# EAGLE design blink1stick_v1a (EAGLE 6.6.0)
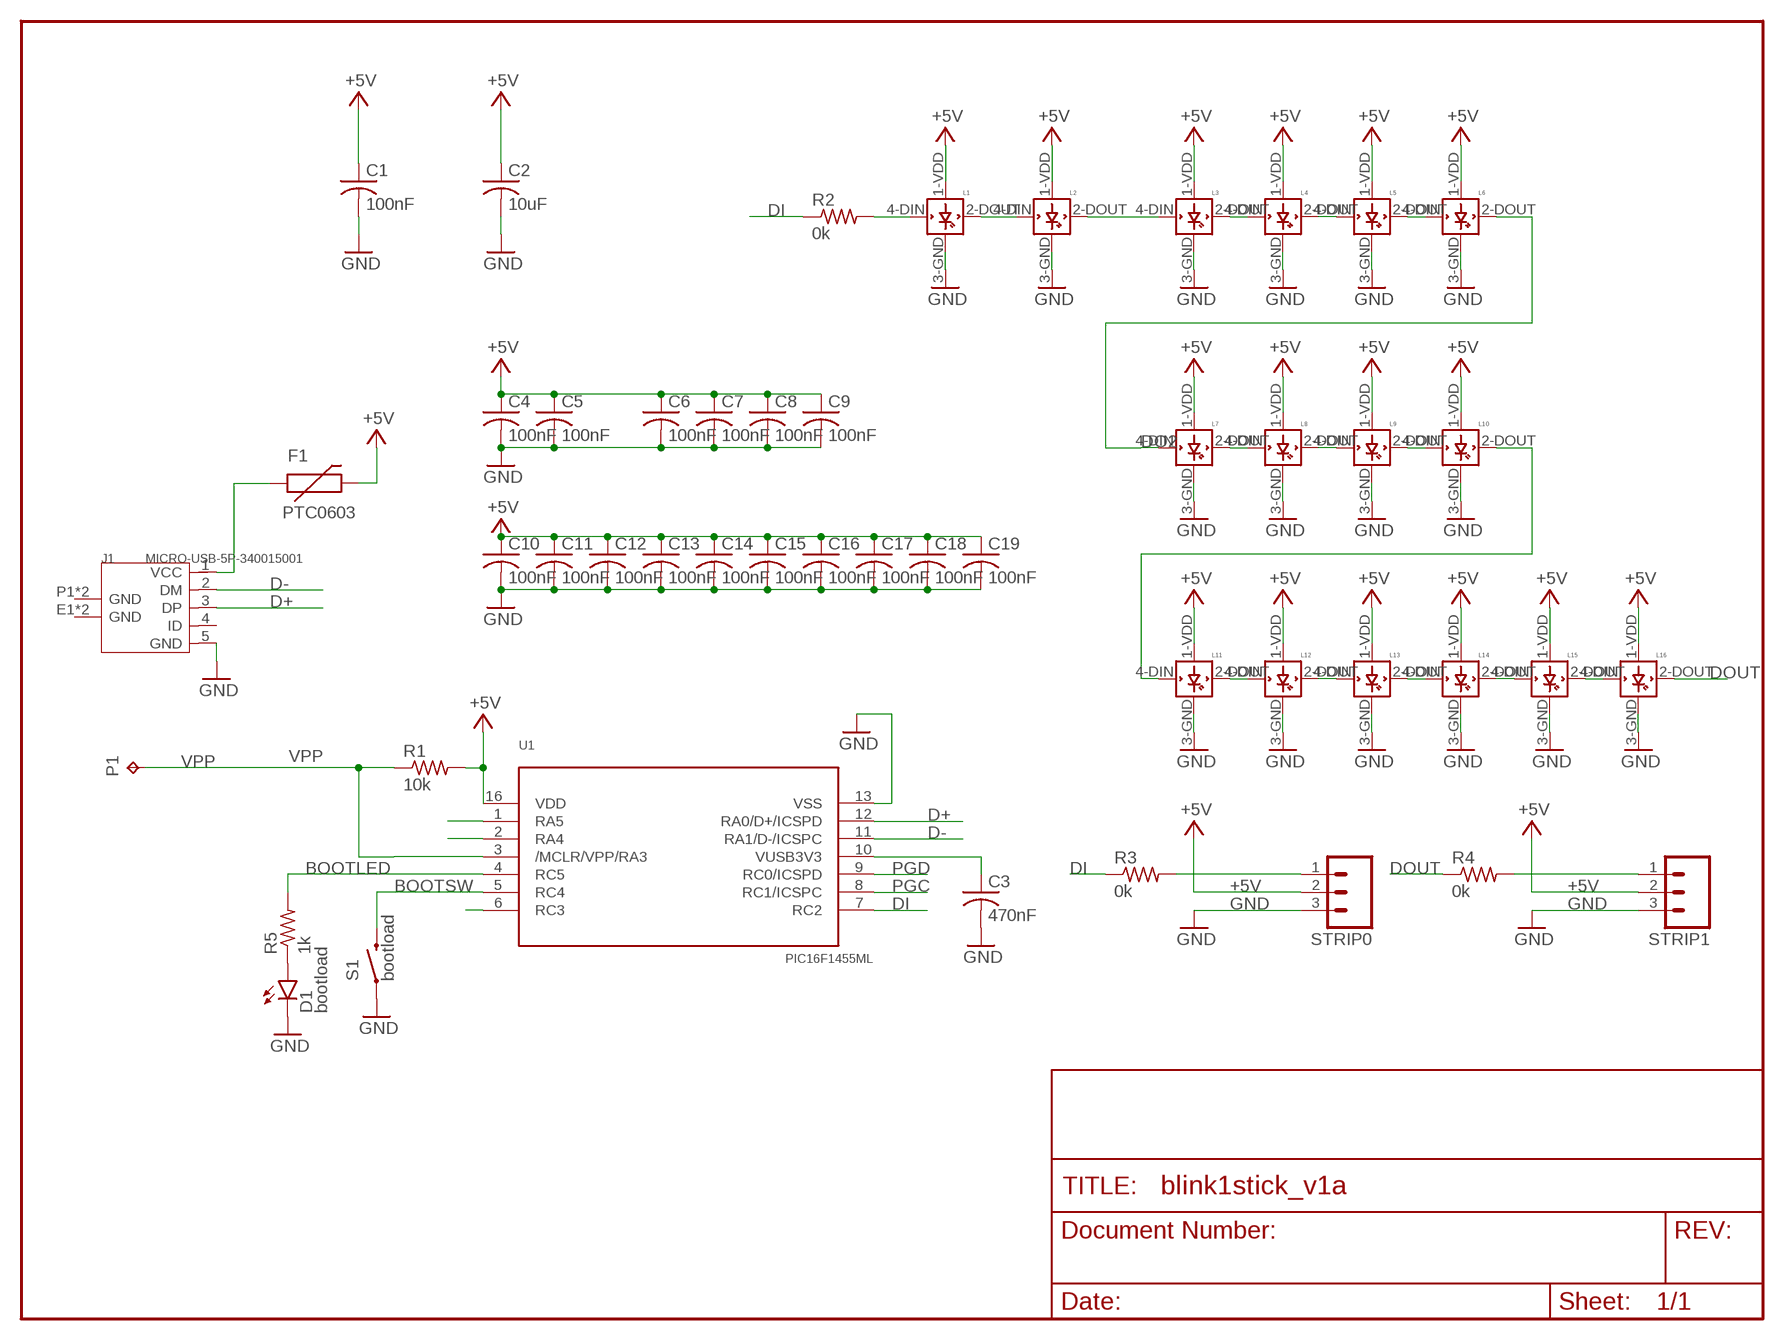
[diagram p0: schematic, sheet 1]

## Parts
C1  100nF  C-USC0603  [C0603]
C2  10uF  C-USC0603  [C0603]
C3  470nF  C-USC0603  [C0603]
C4  100nF  C-USC0603  [C0603]
C5  100nF  C-USC0603  [C0603]
C6  100nF  C-USC0603  [C0603]
C7  100nF  C-USC0603  [C0603]
C8  100nF  C-USC0603  [C0603]
C9  100nF  C-USC0603  [C0603]
C10  100nF  C-USC0603  [C0603]
C11  100nF  C-USC0603  [C0603]
C12  100nF  C-USC0603  [C0603]
C13  100nF  C-USC0603  [C0603]
C14  100nF  C-USC0603  [C0603]
C15  100nF  C-USC0603  [C0603]
C16  100nF  C-USC0603  [C0603]
C17  100nF  C-USC0603  [C0603]
C18  100nF  C-USC0603  [C0603]
C19  100nF  C-USC0603  [C0603]
D1  bootload  LED-RED0603  [LED-0603]
F1  PTC0603  [0603]
J1  MICRO-USB-5P-340015001  [B-SMD-5P]
L1  WS2812B  [WS2812B]
L2  WS2812B  [WS2812B]
L3  WS2812B  [WS2812B]
L4  WS2812B  [WS2812B]
L5  WS2812B  [WS2812B]
L6  WS2812B  [WS2812B]
L7  WS2812B  [WS2812B]
L8  WS2812B  [WS2812B]
L9  WS2812B  [WS2812B]
L10  WS2812B  [WS2812B]
L11  WS2812B  [WS2812B]
L12  WS2812B  [WS2812B]
L13  WS2812B  [WS2812B]
L14  WS2812B  [WS2812B]
L15  WS2812B  [WS2812B]
L16  WS2812B  [WS2812B]
P1  TPTP11SQ  [TP11SQ]
R1  10k  R-US_R0603  [R0603]
R2  0k  R-US_R0603  [R0603]
R3  0k  R-US_R0603  [R0603]
R4  0k  R-US_R0603  [R0603]
R5  1k  R-US_R0603  [R0603]
S1  bootload  SWITCH-MOMENTARY-2TACTILE-SWITCH-SMD-RIGHT-ANGLE  [TACTILE_SWITCH-SMD-RIGHT-ANGLE]
STRIP0  M03PTH  [1X03]
STRIP1  M03PTH  [1X03]
U1  PIC16F1455ML  [QFN16_4X4]

## Nets
+5V: C1.1 C2.1 C4.1 C5.1 C6.1 C7.1 C8.1 C9.1 C10.1 C11.1 C12.1 C13.1 C14.1 C15.1 C16.1 C17.1 C18.1 C19.1 F1.2 L1.1-VDD(VDD) L2.1-VDD(VDD) L3.1-VDD(VDD) L4.1-VDD(VDD) L5.1-VDD(VDD) L6.1-VDD(VDD) L7.1-VDD(VDD) L8.1-VDD(VDD) L9.1-VDD(VDD) L10.1-VDD(VDD) L11.1-VDD(VDD) L12.1-VDD(VDD) L13.1-VDD(VDD) L14.1-VDD(VDD) L15.1-VDD(VDD) L16.1-VDD(VDD) R1.2 STRIP0.2 STRIP1.2 U1.16(VDD)
BOOTLED: R5.2 U1.4(RC5)
BOOTSW: S1.2 U1.5(RC4)
D+: J1.3(DP) U1.12(RA0/D+/ICSPD)
D-: J1.2(DM) U1.11(RA1/D-/ICSPC)
DI: R2.1 R3.1 U1.7(RC2)
DO1: L2.2-DOUT(DOUT) L3.4-DIN(DIN)
DO2: L6.2-DOUT(DOUT) L7.4-DIN(DIN)
DO3: L10.2-DOUT(DOUT) L11.4-DIN(DIN)
DOUT: L16.2-DOUT(DOUT) R4.1
GND: C1.2 C2.2 C3.2 C4.2 C5.2 C6.2 C7.2 C8.2 C9.2 C10.2 C11.2 C12.2 C13.2 C14.2 C15.2 C16.2 C17.2 C18.2 C19.2 D1.C J1.5(GND) L1.3-GND(GND) L2.3-GND(GND) L3.3-GND(GND) L4.3-GND(GND) L5.3-GND(GND) L6.3-GND(GND) L7.3-GND(GND) L8.3-GND(GND) L9.3-GND(GND) L10.3-GND(GND) L11.3-GND(GND) L12.3-GND(GND) L13.3-GND(GND) L14.3-GND(GND) L15.3-GND(GND) L16.3-GND(GND) S1.1 STRIP0.3 STRIP1.3 U1.13(VSS)
N$1: L3.2-DOUT(DOUT) L4.4-DIN(DIN)
N$2: L1.2-DOUT(DOUT) L2.4-DIN(DIN)
N$3: L5.2-DOUT(DOUT) L6.4-DIN(DIN)
N$4: L4.2-DOUT(DOUT) L5.4-DIN(DIN)
N$5: L7.2-DOUT(DOUT) L8.4-DIN(DIN)
N$6: L9.2-DOUT(DOUT) L10.4-DIN(DIN)
N$7: L8.2-DOUT(DOUT) L9.4-DIN(DIN)
N$8: L11.2-DOUT(DOUT) L12.4-DIN(DIN)
N$9: L13.2-DOUT(DOUT) L14.4-DIN(DIN)
N$10: L12.2-DOUT(DOUT) L13.4-DIN(DIN)
N$11: L1.4-DIN(DIN) R2.2
N$12: R3.2 STRIP0.1
N$13: R4.2 STRIP1.1
N$14: L15.2-DOUT(DOUT) L16.4-DIN(DIN)
N$15: L14.2-DOUT(DOUT) L15.4-DIN(DIN)
N$16: U1.6(RC3)
N$19: U1.2(RA4)
N$20: U1.1(RA5)
N$21: D1.A R5.1
PGC: U1.8(RC1/ICSPC)
PGD: U1.9(RC0/ICSPD)
VPP: P1.TP R1.1 U1.3(/MCLR/VPP/RA3)
VUSB: F1.1 J1.1(VCC)
VUSB3V3: C3.1 U1.10(VUSB3V3)
Unconnected: J1.4(ID) J1.E1(GND) J1.E2(GND) J1.P1(GND) J1.P2(GND)

## Library data of the parts
C1-C19 = rcl:C-US: CAPACITOR, American symbol
D1 = SparkFun-LED:LED-RED: Assorted Red LEDs LilyPad 1206- DIO-09912 1206- DIO-00809 0603- DIO-00819; PROD_ID: DIO-00819; VALUE: RED
F1 = SparkFun-PowerIC:PTC: Resettable Fuse PTC Resettable Fuse. Spark Fun Electronics SKU : COM-08357
J1 = OPL Eagle Library:MICRO-USB-5P: ST-USB-001E：MICRO USB B SMD R/A
L1-L16 = adafruit:WS2812B
P1 = testpad:TP: Test pad
R1-R5 = rcl:R-US_: RESISTOR, American symbol
S1 = SparkFun-Electromechanical:SWITCH-MOMENTARY-2: Various NO switches- pushbuttons, reed, etc; PROD_ID: COMP-12265
STRIP0 STRIP1 = SparkFun-Connectors:M03: Header 3 Standard 3-pin 0.1" header. Use with straight break away headers (SKU : PRT-00116), right angle break away headers (PRT-00553), swiss pins (PRT-00743), machine pins (PRT-00117), and female headers (PRT-00115). Molex polarized connector foot print use with SKU : PRT-08232 with associated crimp pins and housings.
U1 = todstuffnew:PIC16F1455

## Board
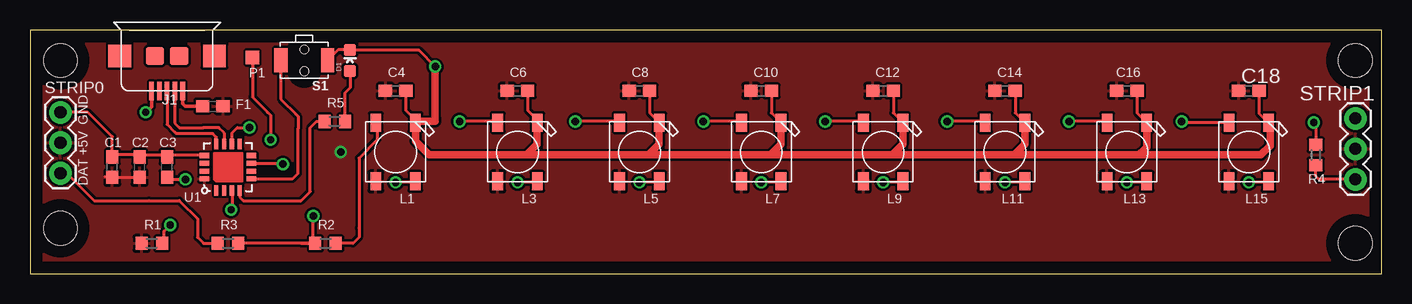
[diagram p1: board, top side]
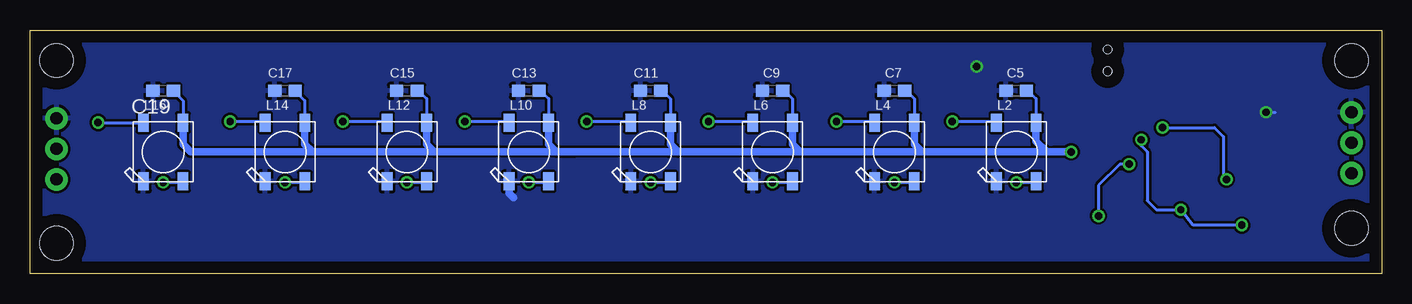
[diagram p2: board, bottom side, seen from below]

Size 112.7 x 20.3 mm. Coordinates in mm from the lower left corner, seen from the top.
Outline: 0,20.3 0,0 112.7,0 112.7,20.3 0,20.3
Copper layers (1*16): Top 0.035mm / dielectric 1.5mm / Bottom 0.035mm
Design rules "default": minimum track width 10mil, minimum drill 24mil, track to track 8mil, track to pad 8mil, pad to pad 8mil, via to via 8mil, smd to smd 8mil, copper to edge 40mil, drill to drill 8mil, minimum pad ring 10mil, minimum via ring 8mil, stop-mask expansion 4mil, vias tented up to drill 0mil, thermal gap 10mil
Holes 2.8 mm at 2.54,17.76 2.54,3.79 110.49,17.76 110.49,2.52

### Footprints (pad centres in the part's own frame; a part is rotated, then mirrored left to right if it is on the bottom)
C0603 = smd 1.1 x 1: 1 -0.85,0; 2 0.85,0
LED-0603 = smd 1 x 1: A 0,-0.877; C 0,0.877
0603 = smd 1.1 x 1: 1 -0.85,0; 2 0.85,0
B-SMD-5P = smd 0.38 x 1.52: 1 -1.3,2.54; 2 -0.65,2.54; 3 0,2.54; 4 0.65,2.54; 5 1.3,2.54 | smd 1.524 x 1.524: E1 -1.016,-0.381; E2 1.016,-0.381 | smd 1.9 x 1.9: P1 -3.95,-0.381; P2 3.95,-0.381
WS2812B = smd 1.5 x 0.9: 1-VDD 2.45,-1.65; 2-DOUT 2.45,1.65; 3-GND -2.45,1.65; 4-DIN -2.45,-1.65
TP11SQ = smd 1.1 x 1.1: TP 0,0
R0603 = smd 1 x 1.1: 1 -0.85,0; 2 0.85,0
TACTILE_SWITCH-SMD-RIGHT-ANGLE = smd 1.1 x 2: 1 -1.95,0; 2 1.95,0 | hole 0.7: 0,0.9; 0,-0.9
1X03 = drill 1.016 pad 1.88: 1 0,0; 2 2.54,0; 3 5.08,0
QFN16_4X4 = smd 0.8 x 0.35: 1 -1.95,0.975; 2 -1.95,0.325; 3 -1.95,-0.325; 4 -1.95,-0.975; 9 1.95,-0.975; 10 1.95,-0.325; 11 1.95,0.325; 12 1.95,0.975 | smd 0.35 x 0.8: 5 -0.975,-1.95; 6 -0.325,-1.95; 7 0.325,-1.95; 8 0.975,-1.95; 13 0.975,1.95; 14 0.325,1.95; 15 -0.325,1.95; 16 -0.975,1.95

### Placement (x,y rotation side)
C1  6.86,8.87 90 top
C2  9.14,8.87 90 top
C3  11.43,8.87 90 top
C4  30.48,15.22 0 top
C5  30.48,15.22 180 bottom
C6  40.64,15.22 0 top
C7  40.64,15.22 180 bottom
C8  50.8,15.22 0 top
C9  50.8,15.22 180 bottom
C10  60.96,15.22 0 top
C11  60.96,15.22 180 bottom
C12  71.12,15.22 0 top
C13  71.12,15.22 180 bottom
C14  81.28,15.22 0 top
C15  81.28,15.22 180 bottom
C16  91.44,15.22 0 top
C17  91.44,15.22 180 bottom
C18  101.6,15.22 0 top
C19  101.6,15.22 180 bottom
D1  26.67,17.76 0 top
F1  15.24,13.95 0 top
J1  11.43,17.76 180 top
L1  30.48,10.14 270 top
L2  30.48,10.14 90 bottom
L3  40.64,10.14 270 top
L4  40.64,10.14 90 bottom
L5  50.8,10.14 270 top
L6  50.8,10.14 90 bottom
L7  60.96,10.14 270 top
L8  60.96,10.14 90 bottom
L9  71.12,10.14 270 top
L10  71.12,10.14 90 bottom
L11  81.28,10.14 270 top
L12  81.28,10.14 90 bottom
L13  91.44,10.14 270 top
L14  91.44,10.14 90 bottom
L15  101.6,10.14 270 top
L16  101.6,10.14 90 bottom
P1  18.54,18.01 270 top
R1  10.16,2.52 180 top
R2  24.64,2.52 0 top
R3  16.51,2.52 180 top
R4  107.19,9.89 270 top
R5  25.4,12.68 180 top
S1  22.86,17.76 180 top
STRIP0  2.54,8.36 90 top
STRIP1  110.49,7.85 90 top
U1  16.51,8.87 90 top

### Tracks (layer width: path | path; a pad name or v marks a point on that pad's centre or on a via)
+5V  (via drill 0.61)
  Top 0.254: 6.26,8.11 C1.1 C2.1
  Bottom 0.254: 89.92,12.68 L14.1-VDD 89.79,14.42 C17.1 | C15.1 80.26,15.22 79.63,14.59 L12.1-VDD 79.76,12.68 | C13.1 70.1,15.22 69.47,14.59 L10.1-VDD 69.6,12.68 | C11.1 59.94,15.22 59.31,14.59 L8.1-VDD | C9.1 49.78,15.22 49.15,14.59 L6.1-VDD | 29.46,15.22 C5.1 29.46,15.22 | 39.62,15.22 C7.1 39.62,15.22 | v25.91,10.14 27.43,10.14 | 39.62,15.22 38.99,14.59 L4.1-VDD | 29.46,15.22 28.83,14.59 L2.1-VDD | C19.1 99.95,14.42 L16.1-VDD
  Bottom 0.61: 58.67,10.14 51.82,10.14 48.51,10.14 | 58.67,10.14 59.44,10.14 67.31,10.14 | 67.31,10.14 68.83,10.14 | 68.83,10.14 67.31,10.14 | 67.31,10.14 68.83,10.14 | 68.83,10.14 78.99,10.14 | 78.99,10.14 79.76,10.14 88.9,10.14 | 88.9,10.14 89.15,10.14 89.79,10.78 L14.1-VDD | 48.51,10.14 47.5,10.14 38.35,10.14 | 38.35,10.14 37.34,10.14 27.94,10.14 | 27.94,10.14 27.43,10.14 | 27.43,10.14 v25.91,10.14 27.43,10.14 | L12.1-VDD 79.63,10.78 78.99,10.14 | L10.1-VDD 69.47,10.78 68.83,10.14 | L8.1-VDD 59.31,10.78 58.67,10.14 | L4.1-VDD 38.99,10.78 38.35,10.14 | L2.1-VDD 28.83,11.03 27.94,10.14 | L6.1-VDD 49.15,10.78 48.51,10.14 | L16.1-VDD 99.95,10.78 99.82,10.65 99.31,10.14 88.9,10.14
  pour Top: -1.27,24.11 -1.27,-3.83 118.11,-3.83 118.11,24.11
BOOTLED
  Top 0.254: R5.2 23.88,12.68 23.37,12.17 23.37,6.84 22.61,6.08 17.78,6.08 17.48,6.37 U1.4
BOOTSW
  Top 0.254: U1.5 19.34,7.9 21.89,7.9 22.35,8.36 22.35,12.08 22.35,13.1 22.18,13.27 20.91,14.54 S1.2
D+
  Top 0.254: J1.3 11.43,12.43 12.06,11.79 | 12.06,11.79 12.19,11.66 | U1.12 15.54,10.86 15.54,11.37 15.24,11.66 12.19,11.66 | 12.19,11.66 12.06,11.79
D-
  Top 0.254: J1.2 12.08,12.54 12.45,12.17 14.48,12.17 15.49,12.17 15.75,12.17 16.18,11.74 U1.11
DI  (via drill 0.61)
  Top 0.254: v23.62,4.81 23.62,2.52 22.61,2.52 | 22.61,2.52 R2.1 22.61,2.52 | 22.61,2.52 17.78,2.52 R3.1 | U1.7 20,9.2 21.01,9.2 v21.08,9.12
  Bottom 0.254: v21.08,9.12 21.84,9.12 23.62,7.35 v23.62,4.81
DO1  (via drill 0.61)
  Top 0.254: v35.81,12.68 38.61,12.68 L3.4-DIN
  Bottom 0.254: v35.81,12.68 32.51,12.68 L2.2-DOUT
DO2  (via drill 0.61)
  Top 0.254: v56.13,12.68 58.93,12.68 L7.4-DIN
  Bottom 0.254: v56.13,12.68 52.83,12.68 L6.2-DOUT
DO3  (via drill 0.61)
  Top 0.254: v76.45,12.68 79.25,12.68 L11.4-DIN
  Bottom 0.254: v76.45,12.68 73.15,12.68 L10.2-DOUT
DOUT  (via drill 0.61)
  Top 0.254: v107.02,12.59 107.19,12.17 R4.1
  Bottom 0.254: v107.02,12.59 L16.2-DOUT
GND  (via drill 0.61)
  Top 0.254: 6.95,9.89 8.64,9.89 C2.2 | 6.95,9.89 6.86,9.89 | 6.86,9.89 6.6,9.89 | 6.6,9.89 C1.2 | 9.14,9.89 11.18,9.89 C3.2 | 9.14,9.89 C2.2 | 10.16,15.22 J1.5 | 9.14,9.89 C2.2 | 6.6,9.89 C1.2 | L1.3-GND 32,12.68 32.26,12.43 32.26,12.68 31.33,13.61 C5.2 | 11.6,9.89 C3.2 | 42.16,12.93 41.91,12.68 | C7.2 41.49,13.61 42.16,12.93 | 42.16,12.93 42.16,12.72 L3.3-GND | C11.2 61.81,13.39 L7.3-GND | C13.2 71.97,13.39 L9.3-GND | C9.2 51.65,13.39 L5.3-GND | C15.2 82.13,13.39 L11.3-GND | C17.2 92.29,13.39 L13.3-GND | 2.79,13.44 STRIP0.3 4.83,13.44 6.35,11.92 6.86,11.41 6.86,9.89 | 6.95,9.89 C1.2 | L15.3-GND 103.12,12.68 102.45,13.35 C19.2 | 24.93,17.88 S1.1 25.69,18.64 D1.C 32.4,18.64 v33.78,17.25 | U1.13 11.43,9.85 C3.2 | 9.14,9.89 6.95,9.89 | 6.95,9.89 6.86,9.89 | 6.86,9.89 6.6,9.89 | 6.6,9.89 6.86,9.89
  Top 0.305: J1.5 10.13,13.92 v9.65,13.44
  Top 0.61: 32,12.68 32.26,12.68 33.78,12.68 33.78,12.93 v33.78,17.25 | L1.3-GND 32.13,11.03 33.27,9.89 40.64,9.89 41.4,9.89 | L3.3-GND 42.29,11.54 42.29,10.77 41.4,9.89 | 41.4,9.89 51.56,9.89 | 51.56,9.89 61.72,9.89 | 61.72,9.89 71.88,9.89 | 71.88,9.89 82.04,9.89 | 82.04,9.89 89.92,9.89 90.68,9.89 91.69,9.89 92.46,9.89 | L11.3-GND 82.93,10.77 82.04,9.89 | L9.3-GND 72.77,10.77 71.88,9.89 | L5.3-GND 52.45,10.77 51.56,9.89 | L7.3-GND 62.61,10.77 61.72,9.89 | L15.3-GND 103.38,12.46 103.38,10.65 102.62,9.89 92.46,9.89 | 92.46,9.89 92.96,10.39 93.09,10.52 L13.3-GND
  Bottom 0.254: v9.65,13.44 8.89,13.44
  Bottom 0.61: L10.3-GND 72.77,6.71 72.39,6.33
  pour Bottom: 1.27,22.84 1.27,-1.29 116.84,-1.29 113.03,20.3 5.08,20.3 5.08,22.84
N$1  (via drill 0.61)
  Top 0.254: v40.64,7.6 42.16,7.6 L3.2-DOUT
  Bottom 0.254: v40.64,7.6 39.12,7.6 L4.4-DIN
N$2  (via drill 0.61)
  Top 0.254: v30.48,7.6 32,7.6 L1.2-DOUT
  Bottom 0.254: v30.48,7.6 28.96,7.6 L2.4-DIN
N$3  (via drill 0.61)
  Top 0.254: v50.8,7.6 52.32,7.6 L5.2-DOUT
  Bottom 0.254: v50.8,7.6 49.28,7.6 L6.4-DIN
N$4  (via drill 0.61)
  Top 0.254: v45.47,12.68 48.77,12.68 L5.4-DIN
  Bottom 0.254: v45.47,12.68 42.67,12.68 L4.2-DOUT
N$5  (via drill 0.61)
  Top 0.254: v60.96,7.6 62.48,7.6 L7.2-DOUT
  Bottom 0.254: v60.96,7.6 59.44,7.6 L8.4-DIN
N$6  (via drill 0.61)
  Top 0.254: v71.12,7.6 72.64,7.6 L9.2-DOUT
  Bottom 0.254: v71.12,7.6 69.6,7.6 L10.4-DIN
N$7  (via drill 0.61)
  Top 0.254: v66.29,12.68 69.09,12.68 L9.4-DIN
  Bottom 0.254: v66.29,12.68 62.99,12.68 L8.2-DOUT
N$8  (via drill 0.61)
  Top 0.254: v81.28,7.6 82.8,7.6 L11.2-DOUT
  Bottom 0.254: v81.28,7.6 79.76,7.6 L12.4-DIN
N$9  (via drill 0.61)
  Top 0.254: v91.44,7.6 92.96,7.6 L13.2-DOUT
  Bottom 0.254: v91.44,7.6 89.92,7.6 L14.4-DIN
N$10  (via drill 0.61)
  Top 0.254: v86.61,12.68 89.41,12.68 L13.4-DIN
  Bottom 0.254: v86.61,12.68 83.31,12.68 L12.2-DOUT
N$11
  Top 0.254: 25.4,2.52 R2.2 26.92,2.52 27.43,3.03 27.43,3.79 27.43,9.63 28.96,11.16 28.96,12.17 L1.4-DIN
N$12
  Top 0.254: R3.2 14.48,2.52 13.97,3.03 13.97,4.55 12.45,6.08 9.91,6.08 5.33,6.08 3.05,8.36 STRIP0.1
N$13
  Top 0.254: R4.2 107.53,8.96 | 107.35,8.87 R4.2 | STRIP1.1 107.44,7.85 107.19,8.11 R4.2
N$14  (via drill 0.61)
  Top 0.254: v101.6,7.6 103.12,7.6 L15.2-DOUT
  Bottom 0.254: v101.6,7.6 100.08,7.6 L16.4-DIN
N$15  (via drill 0.61)
  Top 0.254: L15.4-DIN 96.52,12.59 v96.01,12.68
  Bottom 0.254: v96.01,12.68 93.09,12.68 L14.2-DOUT
N$21
  Top 0.254: D1.A 26.67,15.47 26.25,15.05 R5.1
VPP  (via drill 0.61)
  Top 0.254: v11.68,4.04 11.18,3.54 11.18,2.52 R1.1 | P1.TP 18.54,14.71 19.81,13.44 20.07,13.19 v20.07,11.16 | U1.3 16.84,5.39 v16.76,5.31
  Bottom 0.254: v11.68,4.04 15.75,4.04 v16.76,5.31 18.8,5.31 19.56,6.08 19.56,10.14 20.07,10.65 v20.07,11.16
VUSB
  Top 0.305: J1.1 12.73,14.17 12.95,13.95 F1.1
VUSB3V3  (via drill 0.61)
  Top 0.254: v12.95,7.85 11.68,7.85 C3.1 | U1.10 16.84,11.74 17.27,12.17 v18.29,12.17
  Bottom 0.254: v18.29,12.17 13.97,12.17 13.21,11.41 13.21,8.87 13.21,8.11 v12.95,7.85

### Text on the board
tNames: GND | +5V | DAT